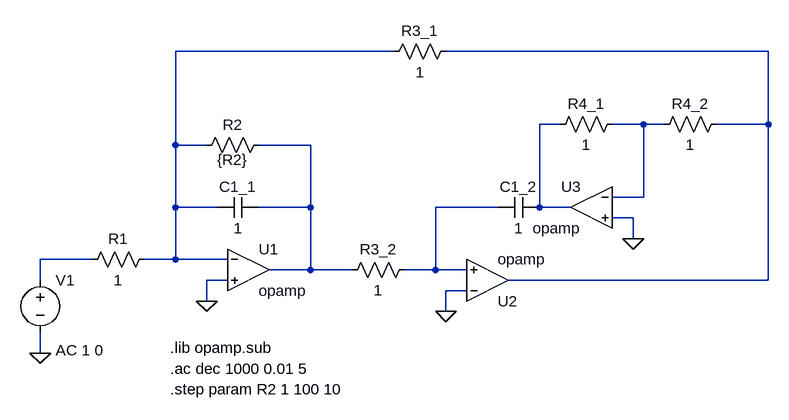
[diagram p0: schematic CircTarea2 - copia.asc]
CircTarea2 - copia.asc, the LTspice schematic file:
Version 4.1
SHEET 1 1160 680
WIRE 576 -144 240 -144
WIRE 1152 -144 656 -144
WIRE 832 -32 800 -32
WIRE 960 -32 912 -32
WIRE 992 -32 960 -32
WIRE 1152 -32 1152 -144
WIRE 1152 -32 1072 -32
WIRE 240 0 240 -144
WIRE 288 0 240 0
WIRE 448 0 368 0
WIRE 960 80 960 -32
WIRE 960 80 912 80
WIRE 240 96 240 0
WIRE 304 96 240 96
WIRE 448 96 448 0
WIRE 448 96 368 96
WIRE 736 96 640 96
WIRE 800 96 800 -32
WIRE 848 96 800 96
WIRE 944 112 912 112
WIRE 944 144 944 112
WIRE 112 176 32 176
WIRE 240 176 240 96
WIRE 240 176 192 176
WIRE 320 176 240 176
WIRE 448 192 448 96
WIRE 448 192 384 192
WIRE 512 192 448 192
WIRE 640 192 640 96
WIRE 640 192 592 192
WIRE 688 192 640 192
WIRE 32 208 32 176
WIRE 320 208 288 208
WIRE 1152 208 1152 -32
WIRE 1152 208 752 208
WIRE 688 224 656 224
WIRE 288 240 288 208
WIRE 656 256 656 224
WIRE 32 320 32 288
FLAG 32 320 0
FLAG 288 240 0
FLAG 656 256 0
FLAG 944 144 0
SYMBOL voltage 32 192 R0
WINDOW 123 24 124 Left 2
WINDOW 39 0 0 Left 0
SYMATTR Value2 AC 1 0
SYMATTR InstName V1
SYMATTR Value ""
SYMBOL res 208 160 R90
WINDOW 0 0 56 VBottom 2
WINDOW 3 32 56 VTop 2
SYMATTR InstName R1
SYMATTR Value 1
SYMBOL OpAmps\\opamp 352 128 R0
SYMATTR InstName U1
SYMBOL OpAmps\\opamp 720 272 M180
SYMATTR InstName U2
SYMBOL OpAmps\\opamp 880 32 M0
SYMATTR InstName U3
SYMBOL cap 368 80 R90
WINDOW 0 0 32 VBottom 2
WINDOW 3 32 32 VTop 2
SYMATTR InstName C1_1
SYMATTR Value 1
SYMBOL res 384 -16 R90
WINDOW 0 0 56 VBottom 2
WINDOW 3 54 56 VBottom 2
SYMATTR InstName R2
SYMATTR Value {R2}
SYMBOL res 608 176 R90
WINDOW 0 0 56 VBottom 2
WINDOW 3 32 56 VTop 2
SYMATTR InstName R3_2
SYMATTR Value 1
SYMBOL cap 800 80 R90
WINDOW 0 0 32 VBottom 2
WINDOW 3 32 32 VTop 2
SYMATTR InstName C1_2
SYMATTR Value 1
SYMBOL res 928 -48 R90
WINDOW 0 0 56 VBottom 2
WINDOW 3 32 56 VTop 2
SYMATTR InstName R4_1
SYMATTR Value 1
SYMBOL res 1088 -48 R90
WINDOW 0 0 56 VBottom 2
WINDOW 3 32 56 VTop 2
SYMATTR InstName R4_2
SYMATTR Value 1
SYMBOL res 672 -160 R90
WINDOW 0 0 56 VBottom 2
WINDOW 3 32 56 VTop 2
SYMATTR InstName R3_1
SYMATTR Value 1
TEXT 232 312 Left 2 !.lib opamp.sub
TEXT 232 344 Left 2 !.ac dec 1000 0.01 5
TEXT 232 376 Left 2 !.step param R2 1 100 10

The netlist it stands for:
* CircTarea2 - copia.asc
V1 N007 0 AC 1 0
R1 N001 N007 1
X§U1 N001 0 N005 opamp Aol=100K GBW=10Meg  ; pins invin noninvin out
X§U2 0 N006 N002 opamp Aol=100K GBW=10Meg  ; pins invin noninvin out
X§U3 N004 0 N003 opamp Aol=100K GBW=10Meg  ; pins invin noninvin out
C1_1 N005 N001 1
R2 N005 N001 {R2}
R3_2 N006 N005 1
C1_2 N003 N006 1
R4_1 N004 N003 1
R4_2 N002 N004 1
R3_1 N002 N001 1
.lib opamp.sub
.ac dec 1000 0.01 5
.step param R2 1 100 10
.backanno
.end